# Altium schematic sheet USBCONN_C_16_and_A.SchDoc
size A3; SheetNumber: 4; SheetTotal: 9
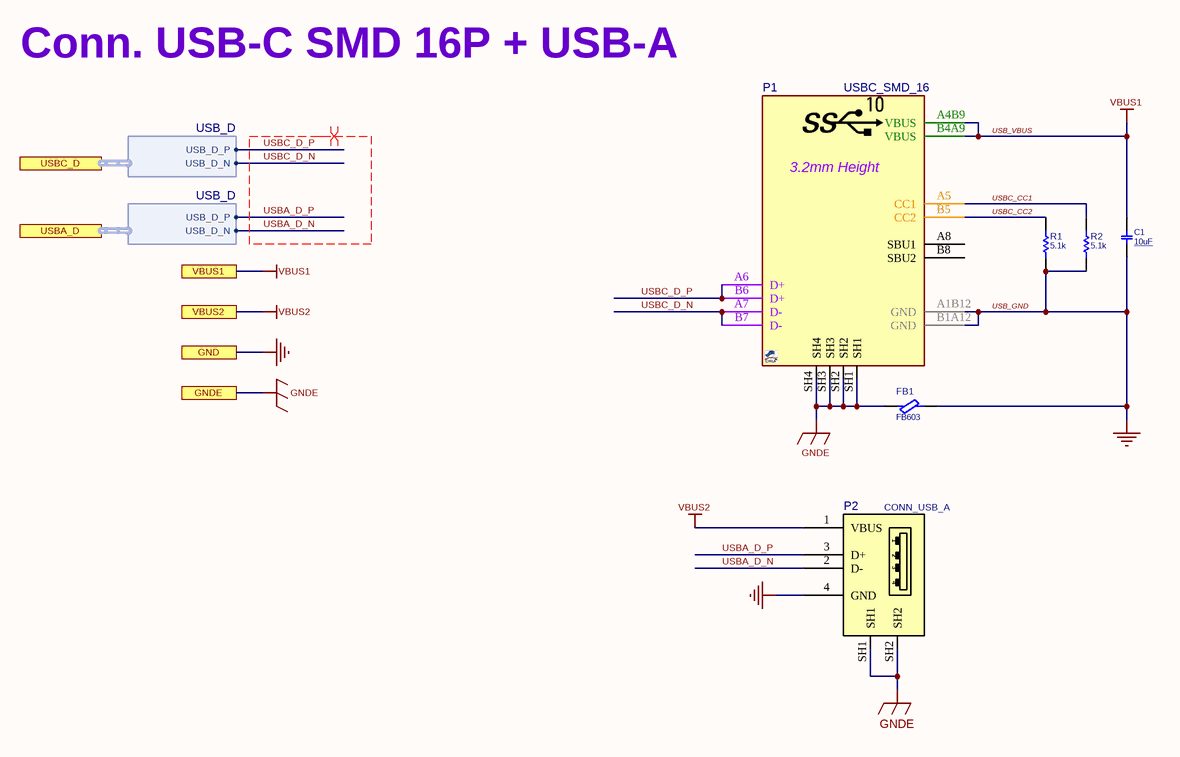
[diagram p0: USBCONN_C_16_and_A.SchDoc]

## Parts
C1  10uF  [C0402]
FB1  FB603  [L0603]
P1  USBC_SMD_16  [USBC_SMD_16_2171790001]
P2  CONN_USB_A  [USB_A_REC_RA_THD_S]
R1  5.1k  [R0402]
R2  5.1k  [R0402]

## Ports
GND, GNDE, USBA_D (harness USB_D), USBC_D (harness USB_D), VBUS1, VBUS2

## Harnesses
USB_D: USB_D_P, USB_D_N

## Nets
GNDE: FB1.1 P1.SH1 P1.SH2 P1.SH3 P1.SH4 P2.SH1 P2.SH2 ; port GNDE
USB_GND: C1.2 FB1.2 P1.A1B12(GND) P1.B1A12(GND) P2.4(GND) R1.1 R2.1 ; port GND  [also labelled GND]
USB_VBUS: C1.1 P1.A4B9(VBUS) P1.B4A9(VBUS) ; port VBUS1  [also labelled VBUS1]
VBUS2: P2.1(VBUS) ; port VBUS2
USBA_D_N: P2.2(D-) ; port USBA_D.USB_D_N
USBA_D_P: P2.3(D+) ; port USBA_D.USB_D_P
USBC_CC1: P1.A5(CC1) R2.2
USBC_CC2: P1.B5(CC2) R1.2
USBC_D_N: P1.A7(D-) P1.B7(D-) ; port USBC_D.USB_D_N
USBC_D_P: P1.A6(D+) P1.B6(D+) ; port USBC_D.USB_D_P

Not connected (* = marked no-connect by the designer): P1 A8(SBU1) B8(SBU2)

## Layout directives
differential pair: USBA_D_N, USBA_D_P, USBC_D_N, USBC_D_P

## Notes on the sheet
- Conn. USB-C SMD 16P + USB-A
- (near P1) 3.2mm Height

## Library data of the parts
C1 = CAP_SMD_MLCC: CAP, MLCC; PARAM: X5R, 20%; MANF: Murata; PARAM2: 10v; PRICE: -; DESC: -; MANF_P#: -; ASSEMBLY: ASSEMBLY; VALUE: 10uF
FB1 = FBEAD_SMD_BLM18KG601: FERRITE_Bead, 0603, 1.3A, 150mOhm, 600@100MHz; MANF: MURATA; MANF_P#: BLM18KG601SN1D; PARAM: 600@100MHz; PARAM2: 1.3A, 150mOhm; PRICE: 0.1$; VALUE: FB603
P1 = CONN_USBC_SMD_16_2171790001: CONN, USB, Type C, USB 2.0, Right-Angle, SMD; MANF: MOLEX; PARAM: 5A; Price: 1.5$; MANF_P#: 2171790001; Value: USBC_SMD_16
P2 = CONN_USB_A_REC_RA_THD_SHORT: CONN, USB, A, RECEPTACLE, R/A, THD; MANF_P#: USBC125; VALUE: CONN_USB_A
R1 R2 = RES_SMD: RESISTOR, SMD; PARAM: 0.063W; DESC: DESCRIPTION; DIST#: MOUSER; PARAM2: 1%; MANF_P#: -; MANF: -; ASSEMBLY: ASSEMBLY; PRICE: 100= 0.5$; VALUE: 5.1k